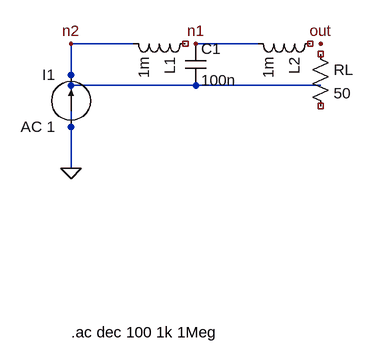
[diagram p0: schematic 00_converter_test_t_filter.asc]
00_converter_test_t_filter.asc, the LTspice schematic file:
Version 4
SHEET 1 880 736
WIRE 0 256 0 192
WIRE 96 192 0 192
WIRE 192 256 0 256
WIRE 0 256 0 384
WIRE 288 192 192 192
WIRE 384 256 0 256
FLAG 0 384 0
FLAG 192 192 n1
FLAG 0 192 n2
FLAG 384 192 out
SYMBOL current 0 320 R180
WINDOW 0 24 80 Left 2
WINDOW 3 24 0 Left 2
SYMATTR InstName I1
SYMATTR Value AC 1
SYMBOL ind 192 176 R90
SYMATTR InstName L1
SYMATTR Value 1m
SYMBOL cap 176 192 R0
SYMATTR InstName C1
SYMATTR Value 100n
SYMBOL ind 384 176 R90
SYMATTR InstName L2
SYMATTR Value 1m
SYMBOL res 368 192 R0
SYMATTR InstName RL
SYMATTR Value 50
TEXT 0 636 Left 2 !.ac dec 100 1k 1Meg

The netlist it stands for:
* 00_converter_test_t_filter.asc
I1 0 0 AC 1
L1 NC_01 0 1m
C1 n1 0 100n
L2 NC_02 n1 1m
RL NC_03 NC_04 50
.ac dec 100 1k 1Meg
.backanno
.end